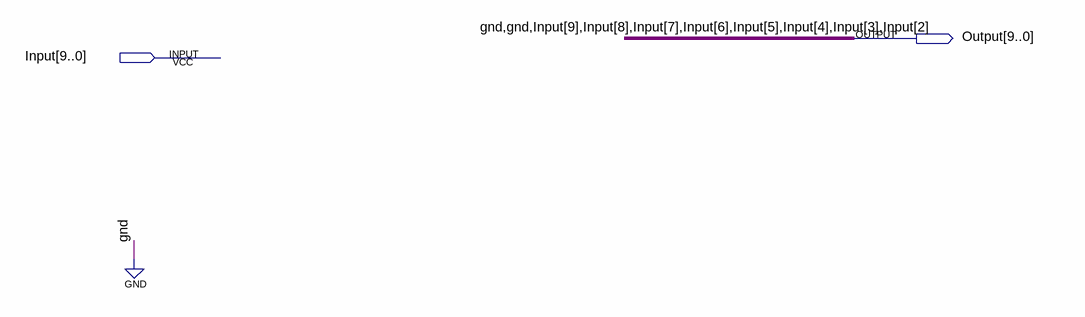
[diagram p0: schematic sheet]
// Quartus schematic DIV4_ForAdr.bdf as structural Verilog: 0 symbols, 2 pins
module DIV4_ForAdr (
  input  [9:0] Input,
  output [9:0] Output
);


  assign Output = {2'b00, Input[9:2]};
endmodule
